# Altium project APBoard.PrjPcb
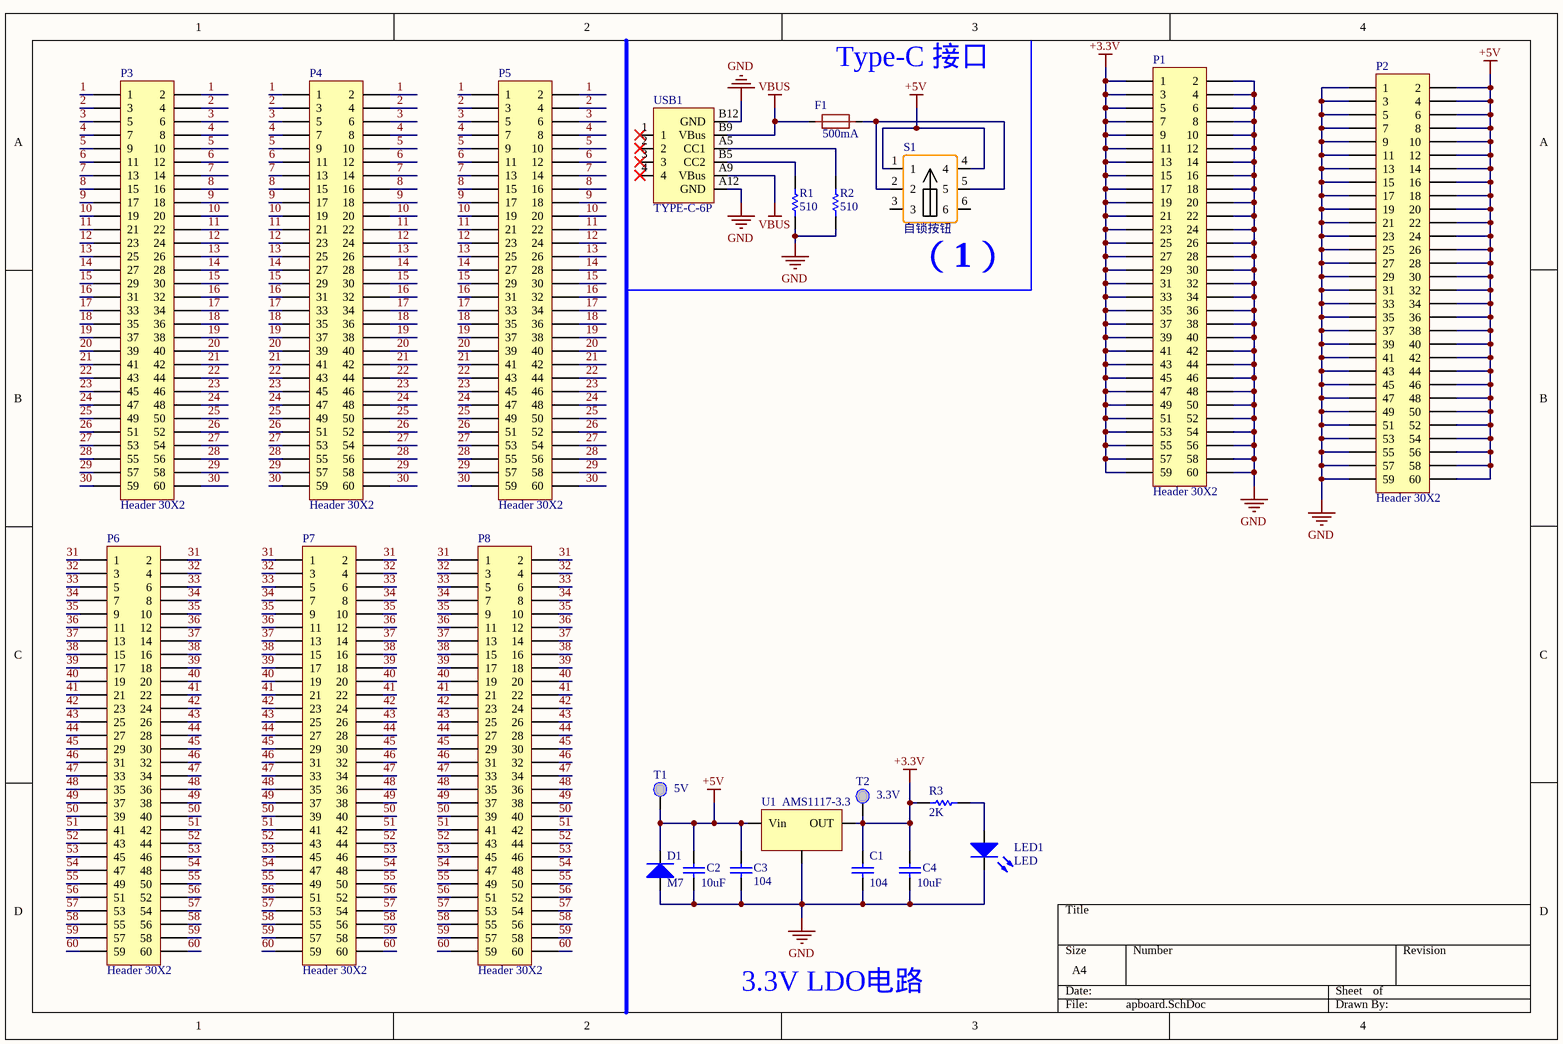
[diagram p0: apboard.SchDoc]
1 sheet, 23 parts. Net scope: global (net labels, ports and power ports of the same name join across sheets).
Board file: apboard.PcbDoc

## Sheet apboard.SchDoc
size A4; SheetNumber: 1; SheetTotal: 1

### Parts
C1  value 104  [C0603]  (hidden comment: Cap)
C2  value 10uF  [C1210]  (hidden comment: Cap)
C3  value 104  [C0603]  (hidden comment: Cap)
C4  value 10uF  [C1210]  (hidden comment: Cap)
D1  M7  [SOD-123_L2.8-W1.8-LS3.7-RD]
F1  500mA  [F0603]
LED1  LED  [LED0603_RED]
P1  Header 30X2  [HDR2X30]
P2  Header 30X2  [HDR2X30]
P3  Header 30X2  [HDR2X30]
P4  Header 30X2  [HDR2X30]
P5  Header 30X2  [HDR2X30]
P6  Header 30X2  [HDR2X30]
P7  Header 30X2  [HDR2X30]
P8  Header 30X2  [HDR2X30]
R1  value 510  [R0603]  (hidden comment: Res)
R2  value 510  [R0603]  (hidden comment: Res)
R3  value 2K  [R0603]  (hidden comment: Res)
S1  自锁按钮  [SW-TH_5.8ZSGT]
T1  5V  [TEST-SMD]
T2  3.3V  [TEST-SMD]
U1  AMS1117-3.3  [SOT-223]
USB1  TYPE-C-6P  [USB-C-SMD_6P]

### Nets
+3.3V: C1.2 C4.2 P1.1 P1.3 P1.5 P1.7 P1.9 P1.11 P1.13 P1.15 P1.17 P1.19 P1.21 P1.23 P1.25 P1.27 P1.29 P1.31 P1.33 P1.35 P1.37 P1.39 P1.41 P1.43 P1.45 P1.47 P1.49 P1.51 P1.53 P1.55 P1.57 P1.59 R3.2 T2.1(TEST) U1.2(OUT)
+5V: C2.2 C3.2 D1.1(K) P2.2 P2.4 P2.6 P2.8 P2.10 P2.12 P2.14 P2.16 P2.18 P2.20 P2.22 P2.24 P2.26 P2.28 P2.30 P2.32 P2.34 P2.36 P2.38 P2.40 P2.42 P2.44 P2.46 P2.48 P2.50 P2.52 P2.54 P2.56 P2.58 P2.60 S1.1 S1.4 T1.1(TEST) U1.3(Vin)
GND: C1.1 C2.1 C3.1 C4.1 D1.2(A) LED1.2(K) P1.2 P1.4 P1.6 P1.8 P1.10 P1.12 P1.14 P1.16 P1.18 P1.20 P1.22 P1.24 P1.26 P1.28 P1.30 P1.32 P1.34 P1.36 P1.38 P1.40 P1.42 P1.44 P1.46 P1.48 P1.50 P1.52 P1.54 P1.56 P1.58 P1.60 P2.1 P2.3 P2.5 P2.7 P2.9 P2.11 P2.13 P2.15 P2.17 P2.19 P2.21 P2.23 P2.25 P2.27 P2.29 P2.31 P2.33 P2.35 P2.37 P2.39 P2.41 P2.43 P2.45 P2.47 P2.49 P2.51 P2.53 P2.55 P2.57 P2.59 R1.2 R2.2 U1.1(GND) USB1.A12(GND) USB1.B12(GND)
VBUS: F1.1 USB1.A9(VBus) USB1.B9(VBus)
1: P3.1 P3.2 P4.1 P4.2 P5.1 P5.2
2: P3.3 P3.4 P4.3 P4.4 P5.3 P5.4
3: P3.5 P3.6 P4.5 P4.6 P5.5 P5.6
4: P3.7 P3.8 P4.7 P4.8 P5.7 P5.8
5: P3.9 P3.10 P4.9 P4.10 P5.9 P5.10
6: P3.11 P3.12 P4.11 P4.12 P5.11 P5.12
7: P3.13 P3.14 P4.13 P4.14 P5.13 P5.14
8: P3.15 P3.16 P4.15 P4.16 P5.15 P5.16
9: P3.17 P3.18 P4.17 P4.18 P5.17 P5.18
10: P3.19 P3.20 P4.19 P4.20 P5.19 P5.20
11: P3.21 P3.22 P4.21 P4.22 P5.21 P5.22
12: P3.23 P3.24 P4.23 P4.24 P5.23 P5.24
13: P3.25 P3.26 P4.25 P4.26 P5.25 P5.26
14: P3.27 P3.28 P4.27 P4.28 P5.27 P5.28
15: P3.29 P3.30 P4.29 P4.30 P5.29 P5.30
16: P3.31 P3.32 P4.31 P4.32 P5.31 P5.32
17: P3.33 P3.34 P4.33 P4.34 P5.33 P5.34
18: P3.35 P3.36 P4.35 P4.36 P5.35 P5.36
19: P3.37 P3.38 P4.37 P4.38 P5.37 P5.38
20: P3.39 P3.40 P4.39 P4.40 P5.39 P5.40
21: P3.41 P3.42 P4.41 P4.42 P5.41 P5.42
22: P3.43 P3.44 P4.43 P4.44 P5.43 P5.44
23: P3.45 P3.46 P4.45 P4.46 P5.45 P5.46
24: P3.47 P3.48 P4.47 P4.48 P5.47 P5.48
25: P3.49 P3.50 P4.49 P4.50 P5.49 P5.50
26: P3.51 P3.52 P4.51 P4.52 P5.51 P5.52
27: P3.53 P3.54 P4.53 P4.54 P5.53 P5.54
28: P3.55 P3.56 P4.55 P4.56 P5.55 P5.56
29: P3.57 P3.58 P4.57 P4.58 P5.57 P5.58
30: P3.59 P3.60 P4.59 P4.60 P5.59 P5.60
31: P6.1 P6.2 P7.1 P7.2 P8.1 P8.2
32: P6.3 P6.4 P7.3 P7.4 P8.3 P8.4
33: P6.5 P6.6 P7.5 P7.6 P8.5 P8.6
34: P6.7 P6.8 P7.7 P7.8 P8.7 P8.8
35: P6.9 P6.10 P7.9 P7.10 P8.9 P8.10
36: P6.11 P6.12 P7.11 P7.12 P8.11 P8.12
37: P6.13 P6.14 P7.13 P7.14 P8.13 P8.14
38: P6.15 P6.16 P7.15 P7.16 P8.15 P8.16
39: P6.17 P6.18 P7.17 P7.18 P8.17 P8.18
40: P6.19 P6.20 P7.19 P7.20 P8.19 P8.20
41: P6.21 P6.22 P7.21 P7.22 P8.21 P8.22
42: P6.23 P6.24 P7.23 P7.24 P8.23 P8.24
43: P6.25 P6.26 P7.25 P7.26 P8.25 P8.26
44: P6.27 P6.28 P7.27 P7.28 P8.27 P8.28
45: P6.29 P6.30 P7.29 P7.30 P8.29 P8.30
46: P6.31 P6.32 P7.31 P7.32 P8.31 P8.32
47: P6.33 P6.34 P7.33 P7.34 P8.33 P8.34
48: P6.35 P6.36 P7.35 P7.36 P8.35 P8.36
49: P6.37 P6.38 P7.37 P7.38 P8.37 P8.38
50: P6.39 P6.40 P7.39 P7.40 P8.39 P8.40
51: P6.41 P6.42 P7.41 P7.42 P8.41 P8.42
52: P6.43 P6.44 P7.43 P7.44 P8.43 P8.44
53: P6.45 P6.46 P7.45 P7.46 P8.45 P8.46
54: P6.47 P6.48 P7.47 P7.48 P8.47 P8.48
55: P6.49 P6.50 P7.49 P7.50 P8.49 P8.50
56: P6.51 P6.52 P7.51 P7.52 P8.51 P8.52
57: P6.53 P6.54 P7.53 P7.54 P8.53 P8.54
58: P6.55 P6.56 P7.55 P7.56 P8.55 P8.56
59: P6.57 P6.58 P7.57 P7.58 P8.57 P8.58
60: P6.59 P6.60 P7.59 P7.60 P8.59 P8.60
NetF1_2: F1.2 S1.2 S1.5
NetLED1_1: LED1.1(A) R3.1
NetR1_1: R1.1 USB1.B5(CC2)
NetR2_1: R2.1 USB1.A5(CC1)

Not connected (* = marked no-connect by the designer): S1 3 6; USB1 1* 2* 3* 4*

### Notes on the sheet
- (near F1) Type-C 接口
- (near S1) （1）
- 3.3V LDO电路

### Library data of the parts
C1-C4 = Cap: 无极性电容; Publisher: 信念D力量
D1 = 1N4007: 1N4007 二极管
F1 = Fuse 1: 保险丝 - Fuse
LED1 = LED: 发光二极管
P1-P8 = Header 30X2: Header, 30-Pin, Dual row; LatestRevisionDate: 17-Jul-2002; LatestRevisionNote: Re-released for DXP Platform.; Publisher: Altium Limited
R1-R3 = Res: 美国电阻符号; Published: 8-Jun-2000; LatestRevisionDate: 29-May-2009; LatestRevisionNote: IPC-7351 Footprint Added.; PackageReference: J1-0603; Publisher: Altium Limited; PackageDescription: Chip Resistor
S1 = 自锁按钮: 自锁按钮开个
T1 T2 = Test
U1 = AMS1117-3.3: 线性稳压芯片 - Voltage Regulator
USB1 = TYPE-C-6P: Type-C USB，6P